# EAGLE design iSecure2.0.1 (EAGLE 9.1.0)
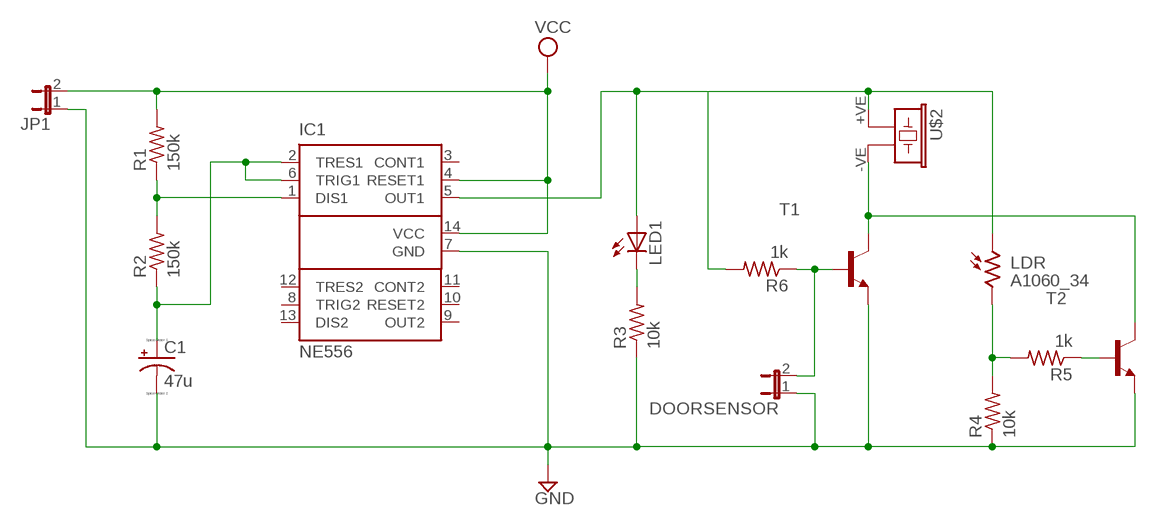
[diagram p0: schematic, sheet 1]

## Parts
C1  47u  CPOL-USTT6D6  [TT5D6]
DOORSENSOR  JP1E  [JP1]
IC1  NE556  [DIL14]
JP1  JP1E  [JP1]
LDR  A1060_34  [T0-46-A10XX]
LED1  LED5MM  [LED5MM]
R1  150k  R-US_0309/12  [0309/12]
R2  150k  R-US_0309/12  [0309/12]
R3  10k  R-US_0309/12  [0309/12]
R4  10k  R-US_0309/12  [0309/12]
R5  1k  R-US_0309/12  [0309/12]
R6  1k  R-US_0309/12  [0309/12]
T1  2N5550-NPN-TO92-CBE  [TO92-CBE]
T2  2N5550-NPN-TO92-CBE  [TO92-CBE]
U$2  BUZZER_AI-1440-TWTBUZZER_POLARISED  [DIP762W70P0L1380H750Q2B]

## Nets
GND: C1.- DOORSENSOR.1 IC1.7(GND) JP1.1 R3.1 R4.1 T1.E T2.E
N$1: IC1.1(DIS1) R1.1 R2.2
N$2: C1.+ IC1.2(TRES1) IC1.6(TRIG1) R2.1
N$3: LED1.K(C) R3.2
N$4: IC1.5(OUT1) LDR.1 LED1.A R6.2 U$2.+VE
N$7: T1.C T2.C U$2.-VE
N$8: DOORSENSOR.2 R6.1 T1.B
N$11: LDR.2 R4.2 R5.2
N$12: R5.1 T2.B
VCC: IC1.4(RESET1) IC1.14(VCC) JP1.2 R1.2
Unconnected: IC1.3(CONT1) IC1.8(TRIG2) IC1.9(OUT2) IC1.10(RESET2) IC1.11(CONT2) IC1.12(TRES2) IC1.13(DIS2)

## Library data of the parts
C1 = resistor:CPOL-US: POLARIZED CAPACITOR, American symbol
DOORSENSOR JP1 = jumper:JP1E: JUMPER
IC1 = st-microelectronics:NE556: General Purpose Biopolartimer; MPN: NE556; OC_FARNELL: 2349784; OC_NEWARK: 83C0108
LDR = photo-elements:A10: Sensor Robust Light Sensing Applications Outdoor Light Sensing Application Source: http://optoelectronics.perkinelmer.com/content/Datasheets/DTS_PhotocellsA1050.pdf
LED1 = led:LED: LED OSRAM: - CHIPLED LG R971, LG N971, LY N971, LG Q971, LY Q971, LO R971, LY R971 LH N974, LH R974 LS Q976, LO Q976, LY Q976 LO Q996 - Hyper CHIPLED LW Q18S LB Q993, LB Q99A, LB R99A - SideLED LS A670, LO A670, LY A670, LG A670, LP A670 LB A673, LV A673, LT A673, LW A673 LH A674 LY A675 LS A676, LA A676, LO A676, LY A676, LW A676 LS A679, LY A679, LG A679 - Hyper Micro SIDELED® LS Y876, LA Y876, LO Y876, LY Y876 LT Y87S - SmartLED LW L88C, LW L88S LB L89C, LB L89S, LG L890 LS L89K, LO L89K, LY L89K LS L896, LA L896, LO L896, LY L896 - TOPLED LS T670, LO T670, LY T670, LG T670, LP T670 LSG T670, LSP T670, LSY T670, LOP T670, LYG T670 LG T671, LOG T671, LSG T671 LB T673, LV T673, LT T673, LW T673 LH T674 LS T676, LA T676, LO T676, LY T676, LB T676, LH T676, LSB T676, LW T676 LB T67C, LV T67C, LT T67C, LS T67K, LO T67K, LY T67K, LW E67C LS E67B, LA E67B, LO E67B, LY E67B, LB E67C, LV E67C, LT E67C LW T67C LS T679, LY T679, LG T679 LS T770, LO T770, LY T770, LG T770, LP T770 LB T773, LV T773, LT T773, LW T773 LH T774 LS E675, LA E675, LY E675, LS T675 LS T776, LA T776, LO T776, LY T776, LB T776 LHGB T686 LT T68C, LB T68C - Hyper Mini TOPLED® LB M676 - Mini TOPLED Santana® LG M470 LS M47K, LO M47K, LY M47K Source: http://www.osram.convergy.de LUXEON: - LUMILED® LXK2-PW12-R00, LXK2-PW12-S00, LXK2-PW14-U00, LXK2-PW14-V00 LXK2-PM12-R00, LXK2-PM12-S00, LXK2-PM14-U00 LXK2-PE12-Q00, LXK2-PE12-R00, LXK2-PE12-S00, LXK2-PE14-T00, LXK2-PE14-U00 LXK2-PB12-K00, LXK2-PB12-L00, LXK2-PB12-M00, LXK2-PB14-N00, LXK2-PB14-P00, LXK2-PB14-Q00 LXK2-PR12-L00, LXK2-PR12-M00, LXK2-PR14-Q00, LXK2-PR14-R00 LXK2-PD12-Q00, LXK2-PD12-R00, LXK2-PD12-S00 LXK2-PH12-R00, LXK2-PH12-S00 LXK2-PL12-P00, LXK2-PL12-Q00, LXK2-PL12-R00 Source: www.luxeon.com KINGBRIGHT: KA-3528ASYC Source: www.kingbright.com
R1-R6 = resistor:R-US_: RESISTOR, American symbol
T1 T2 = transistor:*-NPN-: NPN Transistror BF959 corrected 2008.03.06
U$2 = CDR_custom:BUZZER_AI-1440-TWT

## Board
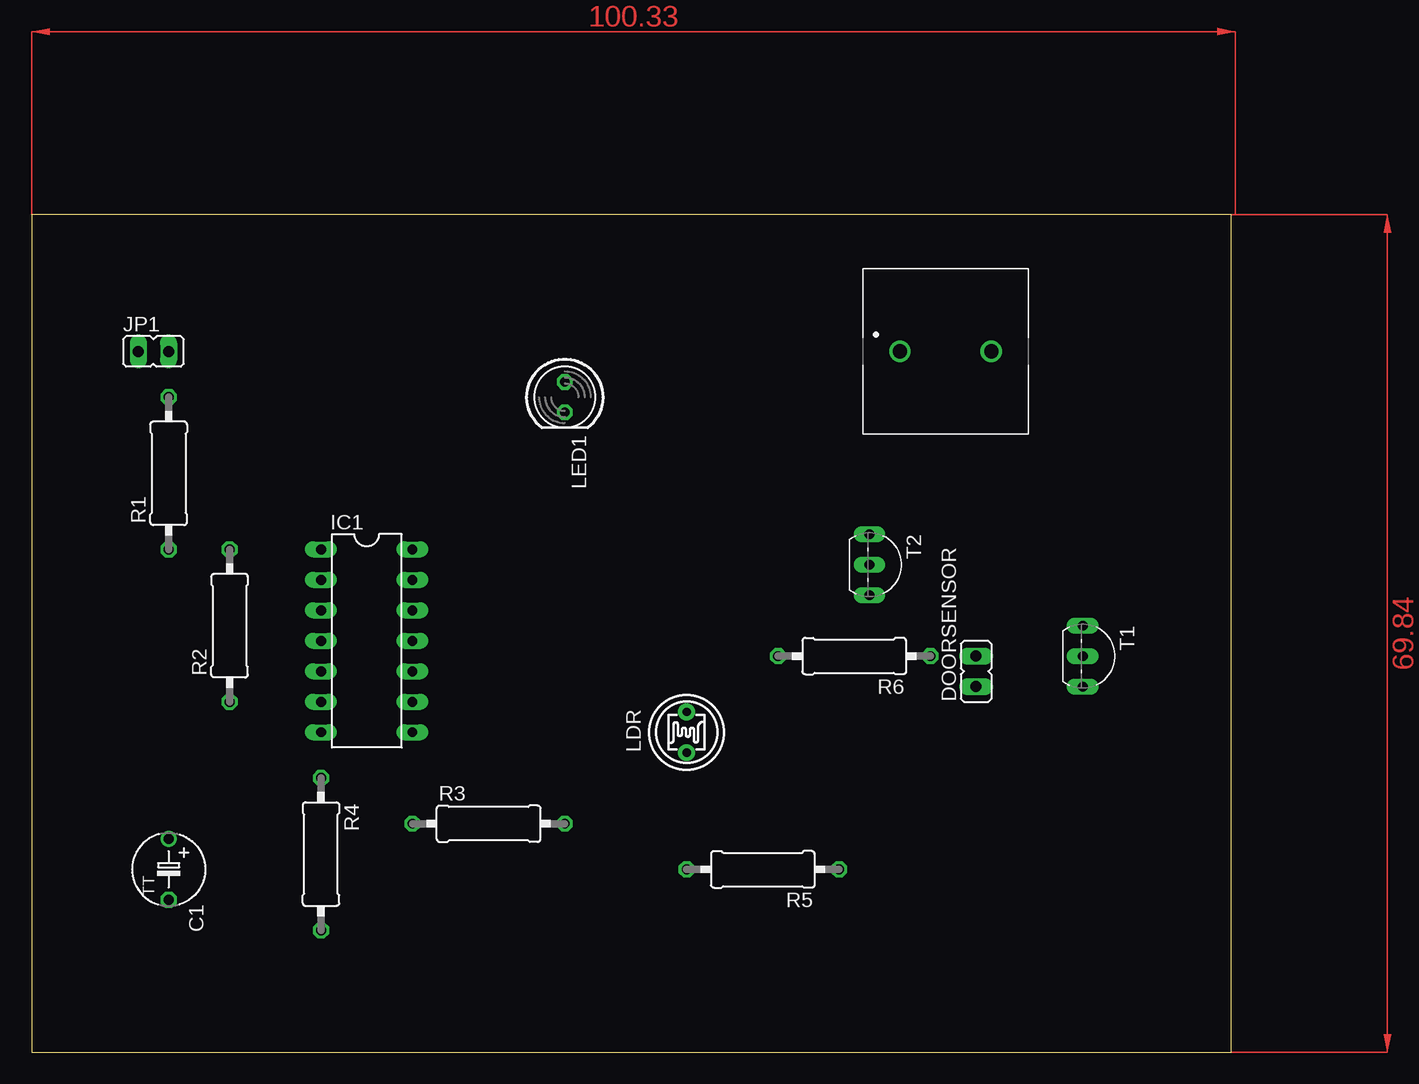
[diagram p1: board, top side]
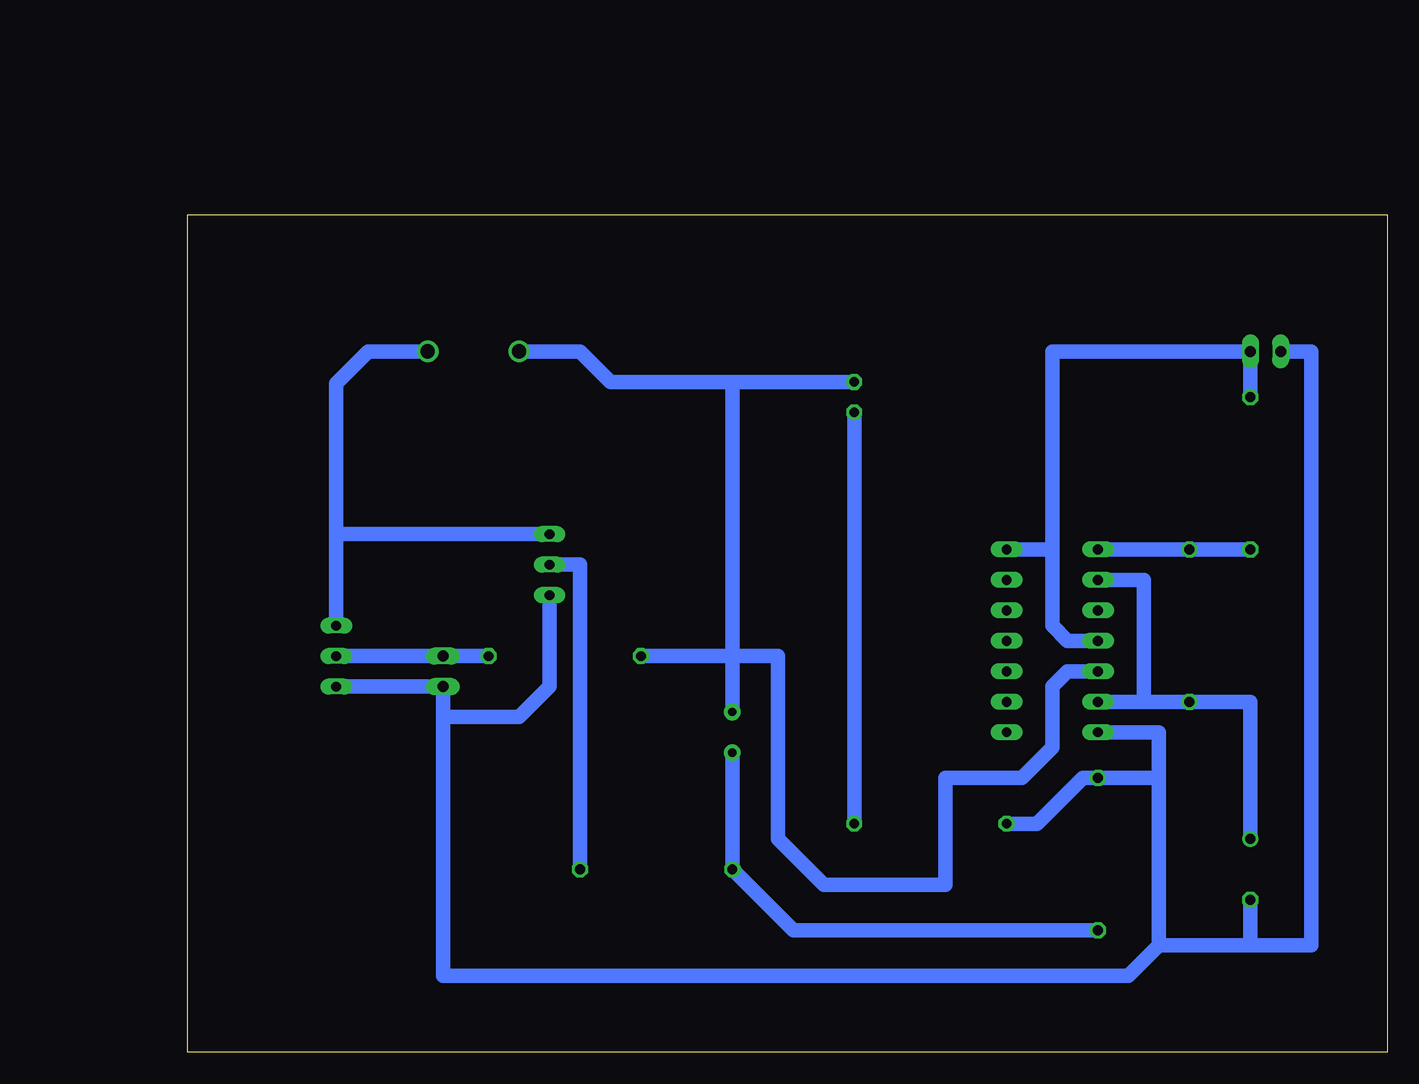
[diagram p2: board, bottom side, seen from below]

Size 100 x 69.84 mm. Coordinates in mm from the lower left corner, seen from the top.
Outline: 0,0 100,0 100,69.84 0,69.84 0,0
Copper layers (1*16): Top 0.035mm / dielectric 1.5mm / Bottom 0.035mm
Design rules "iSecure2.0.1 *": minimum track width 48mil, minimum drill 0.8mm, track to track 24mil, track to pad 24mil, pad to pad 24mil, via to via 0.205mm, smd to smd 6mil, copper to edge 24mil, drill to drill 0.9mm, minimum pad ring 10mil, minimum via ring 8mil, stop-mask expansion 4mil, vias tented up to drill 0mil, thermal gap 10mil

### Footprints (pad centres in the part's own frame; a part is rotated, then mirrored left to right if it is on the bottom)
TT5D6 = drill 0.813: + -2.54,0 | drill 0.813 octagon: - 2.54,0
JP1 = drill 0.914 long: 1 0,-1.27; 2 0,1.27
DIL14 = drill 0.813 long: 1 -7.62,-3.81; 2 -5.08,-3.81; 3 -2.54,-3.81; 4 0,-3.81; 5 2.54,-3.81; 6 5.08,-3.81; 7 7.62,-3.81; 8 7.62,3.81; 9 5.08,3.81; 10 2.54,3.81; 11 0,3.81; 12 -2.54,3.81; 13 -5.08,3.81; 14 -7.62,3.81
T0-46-A10XX = drill 0.7 pad 1.4: 1 -1.7,0; 2 1.7,0
LED5MM = drill 0.813 octagon: A -1.27,0; K 1.27,0
0309/12 = drill 0.813 octagon: 1 -6.35,0; 2 6.35,0
TO92-CBE = drill 0.813 long: B 0,0; C -2.54,0; E 2.54,0
DIP762W70P0L1380H750Q2B = drill 1.19 pad 1.79: +VE -3.81,0; -VE 3.81,0

### Placement (x,y rotation side)
C1  11.43,15.24 270 top
DOORSENSOR  78.74,31.75 0 top
IC1  27.94,34.29 270 top
JP1  10.16,58.42 270 top
LDR  54.61,26.67 270 top
LED1  44.45,54.61 270 top
R1  11.43,48.26 90 top
R2  16.51,35.56 90 top
R3  38.1,19.05 0 top
R4  24.13,16.51 270 top
R5  60.96,15.24 180 top
R6  68.58,33.02 180 top
T1  87.63,33.02 270 top
T2  69.85,40.64 270 top
U$2  76.2,58.42 0 top

### Tracks (layer width: path | path; a pad name or v marks a point on that pad's centre or on a via)
GND
  Bottom 1.219: IC1.7 19.05,26.67 19.05,22.86 | 19.05,22.86 R4.1 25.4,22.86 29.21,19.05 R3.1 | 19.05,22.86 19.05,8.89 | 11.43,8.89 19.05,8.89 | 19.05,8.89 21.59,6.35 78.74,6.35 78.74,27.94 | 78.74,27.94 DOORSENSOR.1 T1.E | T2.E 69.85,30.48 72.39,27.94 78.74,27.94 | JP1.1 6.35,58.42 6.35,8.89 8.89,8.89 11.43,8.89 | C1.- 11.43,8.89
N$1
  Bottom 1.219: R1.1 R2.2 IC1.1
N$2
  Bottom 1.219: C1.+ 11.43,29.21 R2.1 20.32,29.21 | 20.32,29.21 IC1.6 | IC1.2 20.32,39.37 20.32,29.21
N$3
  Bottom 1.219: R3.2 LED1.K
N$4
  Bottom 1.219: R6.2 54.61,33.02 | 54.61,33.02 LDR.1 | 54.61,33.02 50.8,33.02 50.8,17.78 46.99,13.97 36.83,13.97 36.83,22.86 30.48,22.86 27.94,25.4 27.94,30.48 26.67,31.75 IC1.5 | LED1.A 54.61,55.88 | 54.61,33.02 54.61,55.88 | 54.61,55.88 64.77,55.88 67.31,58.42 U$2.+VE
N$7
  Bottom 1.219: T2.C 87.63,43.18 | 87.63,43.18 T1.C | 87.63,43.18 87.63,55.75 84.96,58.42 U$2.-VE
N$8
  Bottom 1.219: R6.1 DOORSENSOR.2 T1.B
N$11
  Bottom 1.219: R4.2 49.53,10.16 R5.2 LDR.2
N$12
  Bottom 1.219: R5.1 67.31,40.64 T2.B
VCC
  Bottom 1.219: IC1.4 26.67,34.29 27.94,35.56 27.94,41.91 | 27.94,41.91 27.94,58.42 JP1.2 R1.2 | IC1.14 27.94,41.91
(copper drawn outside any net)
  shapes: Top area x2